# Altium schematic sheet Encoder Fin ARM - MCU KL05 TQFP 48.SchDoc
size A
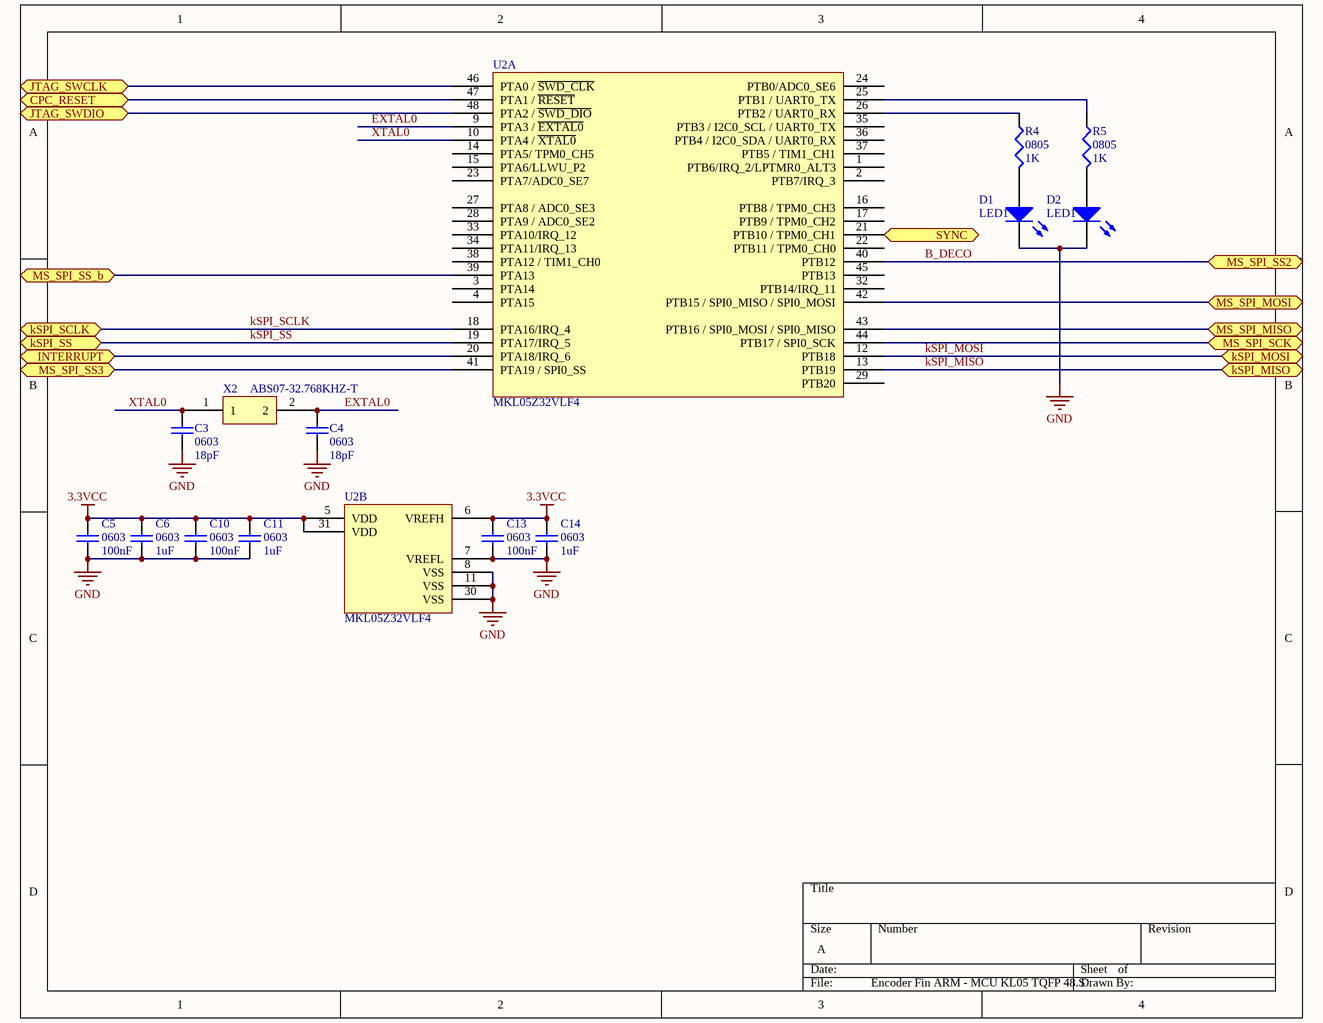
[diagram p0: Encoder Fin ARM - MCU KL05 TQFP 48.SchDoc]

## Parts
C3  0603  value 18pF  [1608[0603]]
C4  0603  value 18pF  [1608[0603]]
C5  0603  value 100nF  [1608[0603]]
C6  0603  value 1uF  [1608[0603]]
C10  0603  value 100nF  [1608[0603]]
C11  0603  value 1uF  [1608[0603]]
C13  0603  value 100nF  [1608[0603]]
C14  0603  value 1uF  [1608[0603]]
D1  LED1  [SM 0805 polarized]
D2  LED1  [SM 0805 polarized]
R4  0805  value 1K  [SM 0805 - gap trimmed]
R5  0805  value 1K  [SM 0805 - gap trimmed]
U2  MKL05Z32VLF4  [MKL05Z32VLF4]  (parts A,B of 2)
X2  ABS07-32.768KHZ-T  [ABS07-32.768KHZ-T]

## Ports
CPC_RESET, INTERRUPT, JTAG_SWCLK, JTAG_SWDIO, kSPI_MISO, kSPI_MOSI, kSPI_SCLK, kSPI_SS, MS_SPI_MISO, MS_SPI_MOSI, MS_SPI_SCK, MS_SPI_SS2, MS_SPI_SS3, MS_SPI_SS_b, SYNC

## Nets
3.3VCC: C5.2 C6.2 C10.2 C11.2 C13.1 C14.1 U2.5(VDD) U2.6(VREFH) U2.31(VDD)
GND: C3.2 C4.2 C5.1 C6.1 C10.1 C11.1 C13.2 C14.2 D1.1(A) D2.1(A) U2.7(VREFL) U2.8(VSS) U2.11(VSS) U2.30(VSS)
B_DECO: U2.40(PTB12) ; port MS_SPI_SS2
CPC_RESET: U2.47(PTA1_/_~{RESET}) ; port CPC_RESET
EXTAL0: C4.1 U2.9(PTA3_/_~{EXTAL0}) X2.2
INTERRUPT: U2.20(PTA18/IRQ_6) ; port INTERRUPT
JTAG_SWCLK: U2.46(PTA0_/_~{SWD_CLK}) ; port JTAG_SWCLK
JTAG_SWDIO: U2.48(PTA2_/_~{SWD_DIO}) ; port JTAG_SWDIO
kSPI_MISO: U2.13(PTB19) ; port kSPI_MISO
kSPI_MOSI: U2.12(PTB18) ; port kSPI_MOSI
kSPI_SCLK: U2.18(PTA16/IRQ_4) ; port kSPI_SCLK
kSPI_SS: U2.19(PTA17/IRQ_5) ; port kSPI_SS
MS_SPI_MISO: U2.43(PTB16_/_SPI0_MOSI_/_SPI0_MISO) ; port MS_SPI_MISO
MS_SPI_MOSI: U2.42(PTB15_/_SPI0_MISO_/_SPI0_MOSI) ; port MS_SPI_MOSI
MS_SPI_SCK: U2.44(PTB17_/_SPI0_SCK) ; port MS_SPI_SCK
MS_SPI_SS3: U2.41(PTA19_/_SPI0_SS) ; port MS_SPI_SS3
MS_SPI_SS_b: U2.39(PTA13) ; port MS_SPI_SS_b
SYNC: U2.21(PTB10_/_TPM0_CH1) ; port SYNC
XTAL0: C3.1 U2.10(PTA4_/_~{XTAL0}) X2.1
NetD1_2: D1.2(K) R4.2
NetD2_2: D2.2(K) R5.2
NetR4_1: R4.1 U2.26(PTB2_/_UART0_RX)
NetR5_1: R5.1 U2.25(PTB1_/_UART0_TX)

Not connected (* = marked no-connect by the designer): U2 1(PTB6/IRQ_2/LPTMR0_ALT3) 2(PTB7/IRQ_3) 3(PTA14) 4(PTA15) 14(PTA5/_TPM0_CH5) 15(PTA6/LLWU_P2) 16(PTB8_/_TPM0_CH3) 17(PTB9_/_TPM0_CH2) 22(PTB11_/_TPM0_CH0) 23(PTA7/ADC0_SE7) 24(PTB0/ADC0_SE6) 27(PTA8_/_ADC0_SE3) 28(PTA9_/_ADC0_SE2) 29(PTB20) 32(PTB14/IRQ_11) 33(PTA10/IRQ_12) 34(PTA11/IRQ_13) 35(PTB3_/_I2C0_SCL_/_UART0_TX) 36(PTB4_/_I2C0_SDA_/_UART0_RX) 37(PTB5_/_TIM1_CH1) 38(PTA12_/_TIM1_CH0) 45(PTB13)

## Library data of the parts
C3-C6 C10 C11 C13 C14 = Cap Semi: Capacitor (Semiconductor SIM Model); Published: 8-Jun-2000; LatestRevisionDate: 29-May-2009; LatestRevisionNote: IPC-7351 Footprint Added.; PackageReference: C1206; Publisher: Altium Limited; PackageDescription: Chip Capacitor
D1 D2 = LED1: Typical RED GaAs LED; Published: 8-Jun-2000; LatestRevisionDate: 08-Jul-2005; LatestRevisionNote: Mech Layer 1 removed.; PackageReference: LED-1; Publisher: Altium Limited; PackageDescription: LED; 2 Leads
R4 R5 = Res3: Resistor; Published: 8-Jun-2000; LatestRevisionDate: 29-May-2009; LatestRevisionNote: IPC-7351 Footprint Added.; PackageReference: J1-0603; Publisher: Altium Limited; PackageDescription: Chip Resistor
U2 = MKL05Z32VLF4: ARM Cortex M0+
X2 = ABS07-32.768KHZ-T: ABS07-32.768KHZ-T RTC Crystal Oscillator